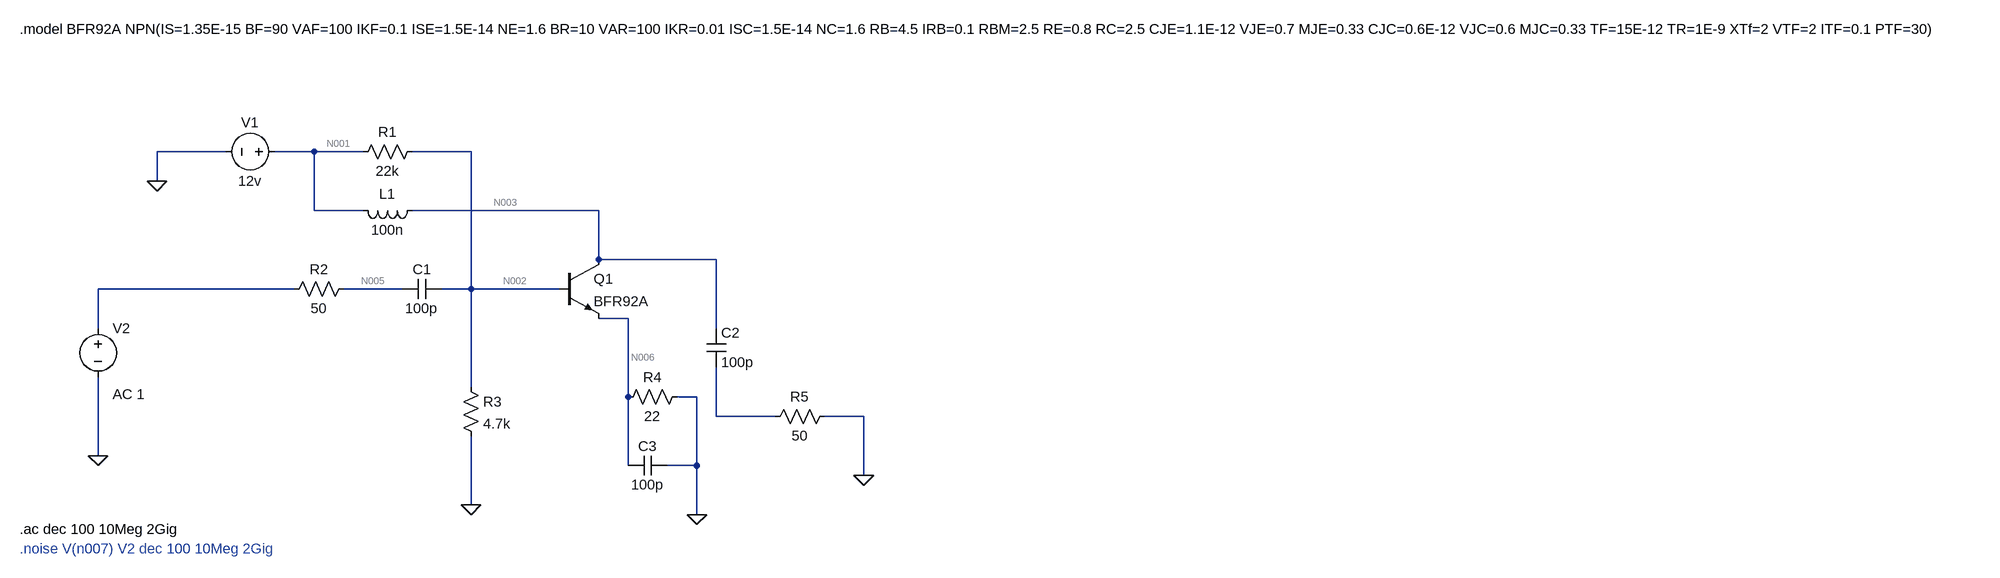
[diagram p0: schematic LTspice LNA.asc]
LTspice LNA.asc, the LTspice schematic file:
Version 4.1
SHEET 1 2916 848
WIRE -144 176 -256 176
WIRE 0 176 -64 176
WIRE 80 176 0 176
WIRE 256 176 160 176
WIRE -256 224 -256 176
WIRE 0 272 0 176
WIRE 80 272 0 272
WIRE 464 272 160 272
WIRE 464 352 464 272
WIRE 656 352 464 352
WIRE -32 400 -352 400
WIRE 144 400 48 400
WIRE 256 400 256 176
WIRE 256 400 208 400
WIRE 400 400 256 400
WIRE 512 448 464 448
WIRE -352 464 -352 400
WIRE 656 464 656 352
WIRE 256 560 256 400
WIRE 512 576 512 448
WIRE 624 576 592 576
WIRE 656 608 656 528
WIRE 752 608 656 608
WIRE 896 608 832 608
WIRE -352 672 -352 544
WIRE 512 688 512 576
WIRE 624 688 624 576
WIRE 624 688 576 688
WIRE 896 704 896 608
WIRE 256 752 256 640
WIRE 624 768 624 688
FLAG 256 752 0
FLAG -352 672 0
FLAG -256 224 0
FLAG 624 768 0
FLAG 896 704 0
SYMBOL voltage -48 176 R90
WINDOW 0 -32 56 VBottom 2
WINDOW 3 32 56 VTop 2
SYMATTR InstName V1
SYMATTR Value 12v
SYMBOL res 176 160 R90
WINDOW 0 0 56 VBottom 2
WINDOW 3 32 56 VTop 2
SYMATTR InstName R1
SYMATTR Value 22k
SYMBOL ind 176 256 R90
WINDOW 0 5 56 VBottom 2
WINDOW 3 32 56 VTop 2
SYMATTR InstName L1
SYMATTR Value 100n
SYMATTR SpiceLine Rser=1m
SYMBOL res 64 384 R90
WINDOW 0 0 56 VBottom 2
WINDOW 3 32 56 VTop 2
SYMATTR InstName R2
SYMATTR Value 50
SYMBOL cap 208 384 R90
WINDOW 0 0 32 VBottom 2
WINDOW 3 32 32 VTop 2
SYMATTR InstName C1
SYMATTR Value 100p
SYMBOL res 240 544 R0
SYMATTR InstName R3
SYMATTR Value 4.7k
SYMBOL res 608 560 R90
WINDOW 0 0 56 VBottom 2
WINDOW 3 32 56 VTop 2
SYMATTR InstName R4
SYMATTR Value 22
SYMBOL npn 400 352 R0
SYMATTR InstName Q1
SYMATTR Value BFR92A
SYMBOL voltage -352 448 R0
WINDOW 123 24 124 Left 2
WINDOW 39 0 0 Left 0
SYMATTR InstName V2
SYMATTR Value ""
SYMATTR Value2 AC 1
SYMBOL res 848 592 R90
WINDOW 0 0 56 VBottom 2
WINDOW 3 32 56 VTop 2
SYMATTR InstName R5
SYMATTR Value 50
SYMBOL cap 640 464 R0
SYMATTR InstName C2
SYMATTR Value 100p
SYMBOL cap 576 672 R90
WINDOW 0 0 32 VBottom 2
WINDOW 3 32 32 VTop 2
SYMATTR InstName C3
SYMATTR Value 100p
TEXT -480 -24 Left 2 !.model BFR92A NPN(IS=1.35E-15 BF=90 VAF=100 IKF=0.1 ISE=1.5E-14 NE=1.6 BR=10 VAR=100 IKR=0.01 ISC=1.5E-14 NC=1.6 RB=4.5 IRB=0.1 RBM=2.5 RE=0.8 RC=2.5 CJE=1.1E-12 VJE=0.7 MJE=0.33 CJC=0.6E-12 VJC=0.6 MJC=0.33 TF=15E-12 TR=1E-9 XTf=2 VTF=2 ITF=0.1 PTF=30)
TEXT -480 792 Left 2 !.ac dec 100 10Meg 2Gig
TEXT -480 824 Left 2 ;.noise V(n007) V2 dec 100 10Meg 2Gig

The netlist it stands for:
* LTspice LNA.asc
V1 N001 0 12v
R1 N002 N001 22k
L1 N003 N001 100n Rser=1m
R2 N005 N004 50
C1 N002 N005 100p
R3 N002 0 4.7k
R4 0 N006 22
Q1 N003 N002 N006 0 BFR92A
V2 N004 0 AC 1
R5 0 N007 50
C2 N003 N007 100p
C3 0 N006 100p
.model NPN NPN
.model PNP PNP
.lib standard.bjt
.model BFR92A NPN(IS=1.35E-15 BF=90 VAF=100 IKF=0.1 ISE=1.5E-14 NE=1.6 BR=10 VAR=100 IKR=0.01 ISC=1.5E-14 NC=1.6 RB=4.5 IRB=0.1 RBM=2.5 RE=0.8 RC=2.5 CJE=1.1E-12 VJE=0.7 MJE=0.33 CJC=0.6E-12 VJC=0.6 MJC=0.33 TF=15E-12 TR=1E-9 XTf=2 VTF=2 ITF=0.1 PTF=30)
.ac dec 100 10Meg 2Gig
* .noise V(n007) V2 dec 100 10Meg 2Gig
.backanno
.end

* Results of the author's LTspice run, read from the files saved beside the schematic
* Operating Point, zero values left out:
*   V(n001) = 12 V
*   V(n002) = 1.226 V
*   V(n003) = 12 V
*   V(n006) = 424.8 mV
*   I(L1) = -19.08 mA
*   I(R1) = -489.7 µA
*   I(R3) = 260.9 µA
*   I(R4) = -19.31 mA
*   I(V1) = -19.57 mA
*   Ib(Q1) = 228.9 µA
*   Ic(Q1) = 19.08 mA
*   Ie(Q1) = -19.31 mA
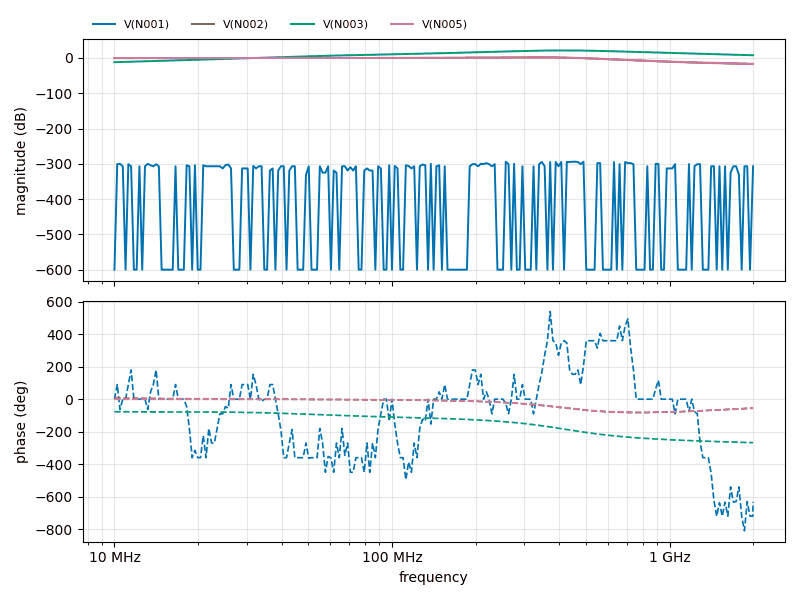
[diagram p1: AC Analysis of LTspice LNA.asc, plotted from the saved traces]
* AC Analysis, 1 run:
*   V(N001): -600.00 dB at 10 MHz, -307.05 dB at 2 GHz, peak -294.04 dB at 257 MHz, 3 dB below the peak at 257 MHz and 259.6 MHz
*   V(N002): -0.57 dB at 10 MHz, -17.04 dB at 2 GHz, peak 1.42 dB at 323.6 MHz, 3 dB below the peak at 518.3 MHz
*   V(N003): -12.08 dB at 10 MHz, 7.57 dB at 2 GHz, peak 21.31 dB at 416.9 MHz, 3 dB below the peak at 258.4 MHz and 664.6 MHz
*   V(N005): -0.33 dB at 10 MHz, -16.26 dB at 2 GHz, peak 1.80 dB at 331.1 MHz, 3 dB below the peak at 526.3 MHz